# Altium schematic sheet 复旦微NB无磁水表.SchDoc
size A3; PageSetup: Record=PageOptions|CenterHorizontal=True|CenterVertical=True|PrintScale=0.90|XCorrection=1.00|YCorrection=1.00|PrintKind=0|BorderSize=5000000|LeftOffset=0|BottomOffset=0|Orientation=2|PaperLength=1000|PaperWidth=1000|Scale=100|PaperSource=7|PrintQuality=-3|MediaType=1|DitherType=10|PrintScaleMode=0|PaperKind=A3|PaperIndex=8
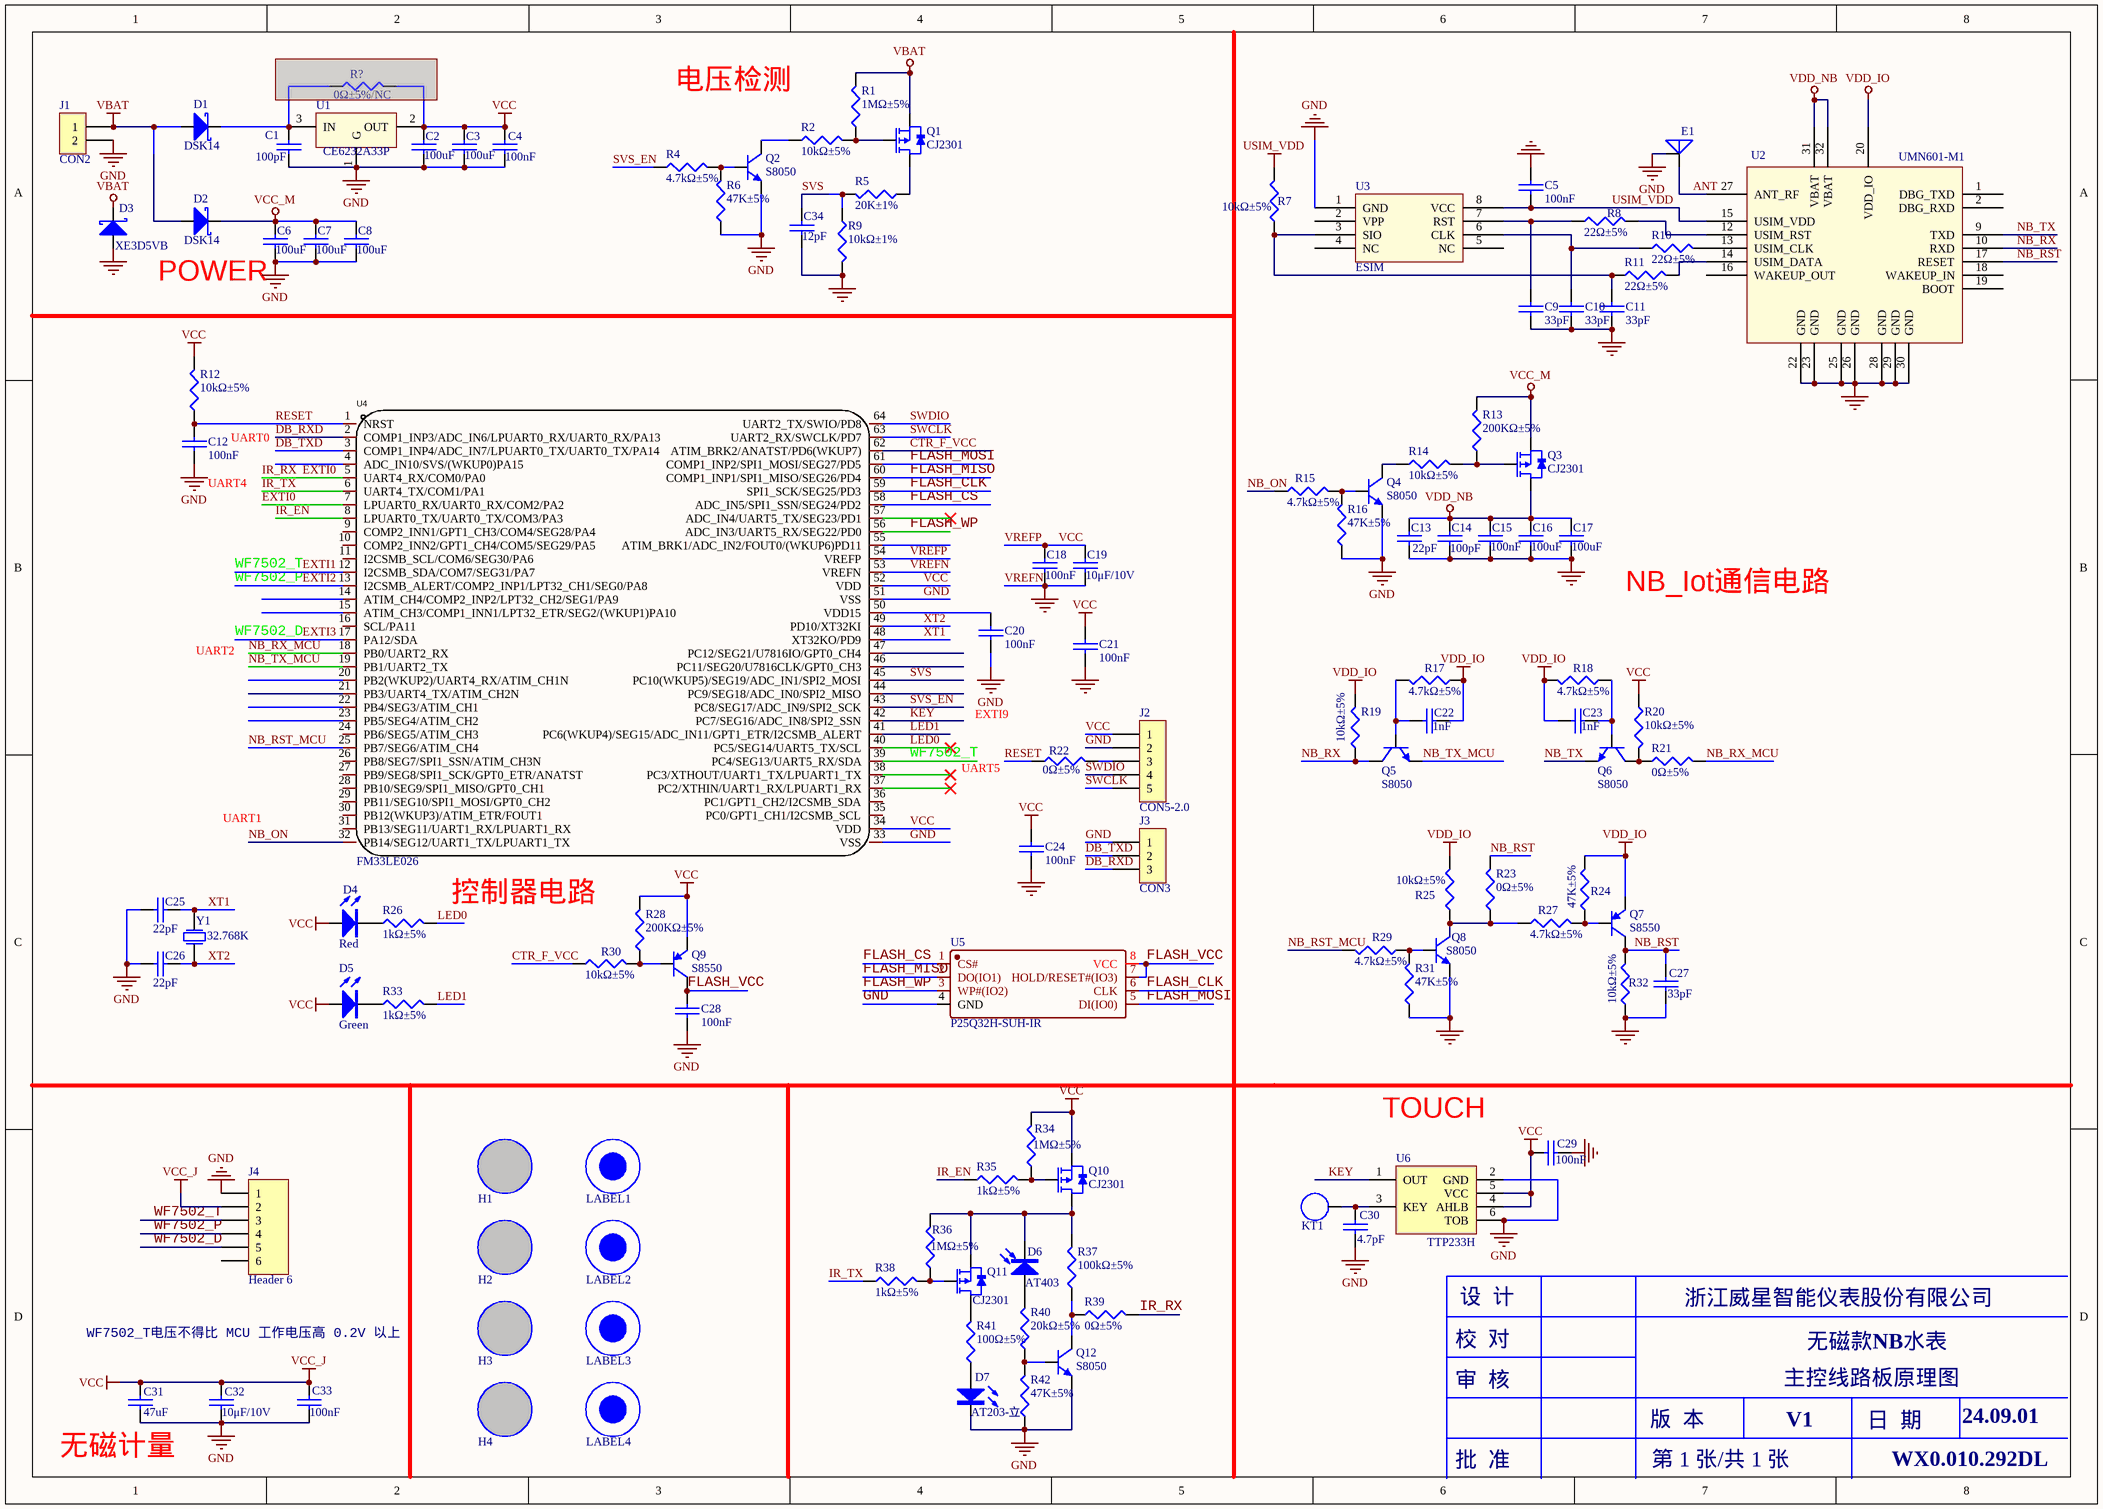
[diagram p0: 复旦微NB无磁水表.SchDoc]

## Parts
C1  100pF  [C0603]
C2  100uF  [C1206]
C3  100uF  [C1206]
C4  100nF  [C0603]
C5  100nF  [C0603]
C6  100uF  [C1206]
C7  100uF  [C1206]
C8  100uF  [C1206]
C9  33pF  [C0603]
C10  33pF  [C0603]
C11  33pF  [C0603]
C12  100nF  [C0603]
C13  22pF  [C0603]
C14  100pF  [C0603]
C15  100nF  [C0603]
C16  100uF  [C1206]
C17  100uF  [C1206]
C18  100nF  [C0603]
C19  10μF/10V  [C0603]
C20  100nF  [C0603]
C21  100nF  [C0603]
C22  1nF  [C0603]
C23  1nF  [C0603]
C24  100nF  [C0603]
C25  22pF  [C0603]
C26  22pF  [C0603]
C27  33pF  [C0603]
C28  100nF  [C0603]
C29  100nF  [C0603]
C30  4.7pF  [C0603]
C31  47uF  [C1210]
C32  10μF/10V  [C0603]
C33  100nF  [C0603]
C34  12pF  [C0603]
D1  DSK14  [SOD-123]
D2  DSK14  [SOD-123]
D3  XE3D5VB  [SOD-323_L1.8-W1.3-LS2.5-RD]
D4  Red  [LED-0603]
D5  Green  [LED-0603]
D6  AT403  [LED-3]
D7  AT203-立  [LED-3]
E1  ANTENNA_3  [ANT-3]  (value not drawn)
H1  (no value)  [HOLE-2.5]  (no BOM)
H2  (no value)  [HOLE-2.5]  (no BOM)
H3  (no value)  [HOLE-2.5]  (no BOM)
H4  (no value)  [HOLE-2.5]  (no BOM)
J1  CON2  [SIP-2]  (no BOM)
J2  CON5-2.0  [J_DIP_2.0_1*05_H]  (no BOM)
J3  CON3  [SIP-3]  (no BOM)
J4  Header 6  [PH1.27-2*3]
KT1  Touch  [TOUCH-1]  (value not drawn)
LABEL1  (no value)  [MARK]  (no BOM)
LABEL2  (no value)  [MARK]  (no BOM)
LABEL3  (no value)  [MARK]  (no BOM)
LABEL4  (no value)  [MARK]  (no BOM)
Q1  CJ2301  [SOT-23]
Q2  S8050  [SOT-23]
Q3  CJ2301  [SOT-23]
Q4  S8050  [SOT-23]
Q5  S8050  [SOT-23]
Q6  S8050  [SOT-23]
Q7  S8550  [SOT-23]
Q8  S8050  [SOT-23]
Q9  S8550  [SOT-23]
Q10  CJ2301  [SOT-23]
Q11  CJ2301  [SOT-23]
Q12  S8050  [SOT-23]
R1  1MΩ±5%  [R0603]
R2  10kΩ±5%  [R0603]
R4  4.7kΩ±5%  [R0603]
R5  20K±1%  [R0603]
R6  47K±5%  [R0603]
R7  10kΩ±5%  [R0603]
R8  22Ω±5%  [R0603]
R9  10kΩ±1%  [R0603]
R10  22Ω±5%  [R0603]
R11  22Ω±5%  [R0603]
R12  10kΩ±5%  [R0603]
R13  200KΩ±5%  [R0603]
R14  10kΩ±5%  [R0603]
R15  4.7kΩ±5%  [R0603]
R16  47K±5%  [R0603]
R17  4.7kΩ±5%  [R0603]
R18  4.7kΩ±5%  [R0603]
R19  10kΩ±5%  [R0603]
R20  10kΩ±5%  [R0603]
R21  0Ω±5%  [R0603]
R22  0Ω±5%  [R0603]
R23  0Ω±5%  [R0603]
R24  47K±5%  [R0603]
R25  10kΩ±5%  [R0603]
R26  1kΩ±5%  [R0603]
R27  4.7kΩ±5%  [R0603]
R28  200KΩ±5%  [R0603]
R29  4.7kΩ±5%  [R0603]
R30  10kΩ±5%  [R0603]
R31  47K±5%  [R0603]
R32  10kΩ±5%  [R0603]
R33  1kΩ±5%  [R0603]
R34  1MΩ±5%  [R0603]
R35  1kΩ±5%  [R0603]
R36  1MΩ±5%  [R0603]
R37  100kΩ±5%  [R0603]
R38  1kΩ±5%  [R0603]
R39  0Ω±5%  [R0603]
R40  20kΩ±5%  [R0603]
R41  100Ω±5%  [R0603]
R42  47K±5%  [R0603]
R?  0Ω±5%/NC  [R0603]  (masked out: inside a compile mask, not in the netlist)
U1  CE6232A33P  [SOT89]
U2  UMN601-M1  [MB26-Y0B]
U3  ESIM  [MFF2]
U4  FM33LE026  [LQFP-64_L10.0-W10.0-P0.50-LS12.0-BL]
U5  P25Q32H-SUH-IR  [SOIC-8]
U6  TTP233H  [SOT-23-6]
Y1  32.768K  [Y3215]

## Nets
GND: C1.1 C2.1 C3.1 C4.1 C5.1 C6.1 C7.1 C8.1 C9.1 C10.1 C11.2 C12.1 C13.1 C14.1 C15.1 C16.1 C17.1 C18.1 C19.1 C20.1 C21.1 C24.1 C25.1 C26.1 C27.1 C28.1 C29.2 C30.1 C31.1 C32.1 C33.1 C34.1 D3.1(A) D7.2(K) E1.2 J1.2 J2.2 J3.1 J4.1 Q2.2(E) Q4.2(E) Q8.2(E) Q12.2(E) R6.1 R9.2 R16.1 R31.1 R32.1 R42.1 U1.1(G) U2.22(GND) U2.23(GND) U2.25(GND) U2.26(GND) U2.28(GND) U2.29(GND) U2.30(GND) U3.1(GND) U4.33(VSS) U4.51(VSS) U4.53(VREFN) U5.4(GND) U6.2(GND) U6.6(TOB)  [also labelled VREFN]
USIM_VDD: C5.2 R7.2 U2.15(USIM_VDD) U3.8(VCC)
VBAT: D1.1(A) D2.1(A) D3.2(K) J1.1 Q1.2(S) R1.2
VCC: C2.2 C3.2 C4.2 C18.2 C19.2 C21.2 C24.2 C29.1 C31.2 C32.2 C33.2 D4.1(A) D5.1(A) J2.1 J4.2 Q9.2(E) Q10.2(S) R12.2 R20.1 R28.2 R34.2 U1.2(OUT) U4.34(VDD) U4.52(VDD) U4.54(VREFP) U6.4(AHLB) U6.5(VCC)  [also labelled VCC_J, VREFP]
VCC_M: C6.2 C7.2 C8.2 D2.2(K) Q3.2(S) R13.2
VDD_IO: C22.2 C23.1 Q7.2(E) R17.1 R18.2 R19.2 R24.2 R25.2 U2.20(VDD_IO)
VDD_NB: C13.2 C14.2 C15.2 C16.2 C17.2 Q3.3(D) U2.31(VBAT) U2.32(VBAT)
ANT: E1.1(A) U2.27(ANT_RF)
CTR_F_VCC: R30.1 U4.62(ATIM_BRK2/ANATST/PD6(WKUP7))
DB_RXD: J3.3 U4.2(COMP1_INP3/ADC_IN6/LPUART0_RX/UART0_RX/PA13)
DB_TXD: J3.2 U4.3(COMP1_INP4/ADC_IN7/LPUART0_TX/UART0_TX/PA14)
EXTI0: R39.2 U4.5(UART4_RX/COM0/PA0) U4.7(LPUART0_RX/UART0_RX/COM2/PA2)  [also labelled IR_RX]
EXTI1: J4.3 U4.12(I2CSMB_SDA/COM7/SEG31/PA7) U4.39(PC4/SEG13/UART5_RX/SDA)  [also labelled WF7502_T]
EXTI2: J4.4 U4.13(I2CSMB_ALERT/COMP2_INP1/LPT32_CH1/SEG0/PA8)  [also labelled WF7502_P]
EXTI3: J4.5 U4.17(PA12/SDA)  [also labelled WF7502_D]
FLASH_CLK: U4.59(SPI1_SCK/SEG25/PD3) U5.6(CLK)
FLASH_CS: U4.58(ADC_IN5/SPI1_SSN/SEG24/PD2) U5.1(CS#)
FLASH_MISO: U4.60(COMP1_INP1/SPI1_MISO/SEG26/PD4) U5.2(DO(IO1))
FLASH_MOSI: U4.61(COMP1_INP2/SPI1_MOSI/SEG27/PD5) U5.5(DI(IO0))
FLASH_VCC: C28.2 Q9.3(C) U5.7(HOLD/RESET#(IO3)) U5.8(VCC)
FLASH_WP: U4.56(ADC_IN3/UART5_RX/SEG22/PD0) U5.3(WP#(IO2))
IR_EN: R35.1 U4.8(LPUART0_TX/UART0_TX/COM3/PA3)
IR_TX: R38.1 U4.6(UART4_TX/COM1/PA1)
KEY: U4.42(PC7/SEG16/ADC_IN8/SPI2_SSN) U6.1(OUT)
LED0: R26.2 U4.40(PC5/SEG14/UART5_TX/SCL)
LED1: R33.2 U4.41(PC6(WKUP4)/SEG15/ADC_IN11/GPT1_ETR/I2CSMB_ALERT)
NB_ON: R15.1 U4.32(PB14/SEG12/UART1_TX/LPUART1_TX)
NB_RST: C27.2 Q7.3(C) R23.2 R32.2 U2.17(RESET)
NB_RST_MCU: R29.2 U4.25(PB7/SEG6/ATIM_CH4)
NB_RX: Q5.3(C) R19.1 U2.10(RXD)
NB_RX_MCU: R21.2 U4.18(PB0/UART2_RX)
NB_TX: Q6.2(E) U2.9(TXD)
NB_TX_MCU: Q5.2(E) U4.19(PB1/UART2_TX)
RESET: C12.2 R12.1 R22.1 U4.1(NRST)
SVS: C34.2 R5.2 R9.1 U4.45(PC10(WKUP5)/SEG19/ADC_IN1/SPI2_MOSI)
SVS_EN: R4.1 U4.43(PC8/SEG17/ADC_IN9/SPI2_SCK)
SWCLK: J2.5 U4.63(UART2_RX/SWCLK/PD7)
SWDIO: J2.4 U4.64(UART2_TX/SWIO/PD8)
XT1: C25.2 U4.48(XT32KO/PD9) Y1.2(P2)
XT2: C26.2 U4.49(PD10/XT32KI) Y1.1(P1)
NetC1_2: C1.2 D1.2(K) U1.3(IN)
NetC9_2: C9.2 R8.1 U3.7(RST)
NetC10_2: C10.2 R10.1 U3.6(CLK)
NetC11_1: C11.1 R7.1 R11.1 U3.3(SIO)
NetC20_2: C20.2 U4.50(VDD15)
NetC22_1: C22.1 Q5.1(B) R17.2
NetC23_2: C23.2 Q6.1(B) R18.1
NetC30_2: C30.2 KT1.1 U6.3(KEY)
NetD4_2: D4.2(K) R26.1
NetD5_2: D5.2(K) R33.1
NetD6_1: D6.1(A) R40.2
NetD6_2: D6.2(K) Q10.3(D) Q11.2(S) R36.2 R37.2
NetD7_1: D7.1(A) R41.1
NetJ2_3: J2.3 R22.2
NetQ1_1: Q1.1(G) R1.1 R2.2
NetQ1_3: Q1.3(D) R5.1
NetQ2_1: Q2.1(B) R4.2 R6.2
NetQ2_3: Q2.3(C) R2.1
NetQ3_1: Q3.1(G) R13.1 R14.2
NetQ4_1: Q4.1(B) R15.2 R16.2
NetQ4_3: Q4.3(C) R14.1
NetQ6_3: Q6.3(C) R20.2 R21.1
NetQ7_1: Q7.1(B) R24.1 R27.2
NetQ8_1: Q8.1(B) R29.1 R31.2
NetQ8_3: Q8.3(C) R23.1 R25.1 R27.1
NetQ9_1: Q9.1(B) R28.1 R30.2
NetQ10_1: Q10.1(G) R34.1 R35.2
NetQ11_1: Q11.1(G) R36.1 R38.2
NetQ11_3: Q11.3(D) R41.2
NetQ12_1: Q12.1(B) R40.1 R42.2
NetQ12_3: Q12.3(C) R37.1 R39.1
NetR8_2: R8.2 U2.12(USIM_RST)
NetR10_2: R10.2 U2.13(USIM_CLK)
NetR11_2: R11.2 U2.14(USIM_DATA)

Not connected (* = marked no-connect by the designer): J4 6; U2 1(DBG_TXD) 2(DBG_RXD) 16(WAKEUP_OUT) 18(WAKEUP_IN) 19(BOOT); U3 2(VPP) 4(NC) 5(NC); U4 4(ADC_IN10/SVS/(WKUP0)PA15) 9(COMP2_INN1/GPT1_CH3/COM4/SEG28/PA4) 10(COMP2_INN2/GPT1_CH4/COM5/SEG29/PA5) 11(I2CSMB_SCL/COM6/SEG30/PA6) 14(ATIM_CH4/COMP2_INP2/LPT32_CH2/SEG1/PA9) 15(ATIM_CH3/COMP1_INN1/LPT32_ETR/SEG2/(WKUP1)PA10) 16(SCL/PA11) 20(PB2(WKUP2)/UART4_RX/ATIM_CH1N) 21(PB3/UART4_TX/ATIM_CH2N) 22(PB4/SEG3/ATIM_CH1) 23(PB5/SEG4/ATIM_CH2) 24(PB6/SEG5/ATIM_CH3) 26(PB8/SEG7/SPI1_SSN/ATIM_CH3N) 27(PB9/SEG8/SPI1_SCK/GPT0_ETR/ANATST) 28(PB10/SEG9/SPI1_MISO/GPT0_CH1) 29(PB11/SEG10/SPI1_MOSI/GPT0_CH2) 30(PB12(WKUP3)/ATIM_ETR/FOUT1) 31(PB13/SEG11/UART1_RX/LPUART1_RX) 35(PC0/GPT1_CH1/I2CSMB_SCL) 36(PC1/GPT1_CH2/I2CSMB_SDA) 37(PC2/XTHIN/UART1_RX/LPUART1_RX)* 38(PC3/XTHOUT/UART1_TX/LPUART1_TX)* 44(PC9/SEG18/ADC_IN0/SPI2_MISO) 46(PC11/SEG20/U7816CLK/GPT0_CH3) 47(PC12/SEG21/U7816IO/GPT0_CH4) 55(ATIM_BRK1/ADC_IN2/FOUT0/(WKUP6)PD11) 57(ADC_IN4/UART5_TX/SEG23/PD1)*

## Notes on the sheet
- 电压检测
- POWER
- UART0
- (near C12) UART4
- UART2
- NB_Iot通信电路
- EXTI9
- UART5
- UART1
- 控制器电路
- TOUCH
- 设  计
- 浙江威星智能仪表股份有限公司
- WF7502_T电压不得比 MCU 工作电压高 0.2V 以上
- 审  核
- 校  对
- 主控线路板原理图
- 无磁款NB水表
- (near C31) 无磁计量
- 版  本
- V1
- 日  期
- 24.09.01
- 批  准
- 第 1 张/共 1 张
- WX0.010.292DL

## Library data of the parts
C1 C14 = 9: 贴片电容,100pF±10%/50V,NP0,国巨; Part Number: 101020103-0010; Manufacturer P/N: CC0603JRNPO9BN101; ID: 9; Part Name: 贴片电容; Manufacturer: 国巨
C2 C3 C6-C8 C16 C17 = 16: 贴片电容,100uF±20%/6.3V,X5R,村田; Part Number: 101020101-0020; Manufacturer P/N: GRM31CR60J107ME39L; ID: 16; Part Name: 贴片电容; Manufacturer: 村田
C4 C5 C12 C15 C18 C20 C21 C24 C28 C29 C33 = 1: 贴片电容,100nF±10%/50V,X7R,国巨; Part Number: 101020103-0021; Manufacturer P/N: CC0603KRX7R9BB104; ID: 1; Part Name: 贴片电容; Manufacturer: 国巨
C9-C11 C27 = 4: 贴片电容,33pF±10%/50V,NP0,国巨; Part Number: 101020103-0027; Manufacturer P/N: CC0603KRNPO9BN33; ID: 4; Part Name: 贴片电容; Manufacturer: 国巨
C13 C25 C26 = 3: 贴片电容,22pF±5%/50V,NP0,国巨; Part Number: 101020103-0009; Manufacturer P/N: CC0603JRNPO9BN22; ID: 3; Part Name: 贴片电容; Manufacturer: 国巨
C19 C32 = 8: 贴片电容,10μF±10%/10V,X7R,村田; Part Number: 101020103-0026; Manufacturer P/N: GRM188R61A106KE47D; ID: 8; Part Name: 贴片电容; Manufacturer: 村田
C22 C23 = 6: 贴片电容,1nF±10%/50V,X7R,国巨; Part Number: 101020103-0022; Manufacturer P/N: CC0603KRX7R9BB102; ID: 6; Part Name: 贴片电容; Manufacturer: 国巨
C30 = 18: 贴片电容,4.7pF±0.25pF/50V,NPO,国巨; Part Number: 101020103-0040; Manufacturer P/N: CC0603CRNP09BN4R7; ID: 18; Part Name: 贴片电容; Manufacturer: 国巨
C31 = 11: 贴片电容,47uF±10%/16V,NP0,村田; Part Number: 101020105-0003; Manufacturer P/N: GRM32ER61C476KE15L; ID: 11; Part Name: 贴片电容; Manufacturer: 村田
C34 = 15: 贴片电容,12pF±5%/50V,NPO,国巨; Part Number: 101020103-0005; Manufacturer P/N: CC0603JRNPO9BN12; ID: 15; Part Name: 贴片电容; Manufacturer: 国巨
D1 D2 = 8: DSK14,SOD-123FL,1 A,40 V,28 V,台湾强茂集团苏州群鑫电子,DSK14; Part Number: 101040101-0043; Part Name: 贴片二极管; ID: 8; Manufacturer: 台湾强茂集团苏州群鑫电子
D3 = 12: 具有3.5pF低结电容，适用于IO线、电源线、高速信号的ESD二极管阵列,SOD-323,5 V,5 V,350 W,5 A,1 uA,矽航,XE3D5VB; Part Number: 101040104-0010; Part Name: ESD管; ID: 12; Manufacturer: 矽航
D4 = 3: 发光二极管,红色,0603,光宝; Part Number: 101040102-0006; ID: 3; Part Name: 发光二极管; Manufacturer: 光宝
D5 = 5: 发光二极管,绿色,亿光，19-217/GHC-YR1S2/3T; Part Number: 101040102-0018; Part Name: 贴片发光二极管; Manufacturer: 亿光; ID: 5; Manufacturer P/N: 19-217/GHC-YR1S2/3T
D6 = 6: 红外接收头，插件，红光，AT403_PD_01; Part Number: 101040102-0011; Part Name: 红外接收管; Manufacturer: 品观; ID: 6; SMD/DIP: DIP
D7 = 5: 红外发射头，插件，红光，AT203; Part Number: 101040102-0010; Part Name: 红外发射管; Manufacturer: 品观; ID: 5
E1 = 28: 外置天线焊盘（固定孔）; Part Name: 虚拟器件; ID: 28; Part Number: *
H1-H4 = 22: 定位孔,孔径2.5mm,非金属化,无电气连接; Part Name: 虚拟器件; ID: 22; Part Number: *
J1 = 1: 焊接插座,间距2.54mm; ID: 1; Part Number: *; Part Name: 焊接插座
J2 = 15: 焊接插座,间距2.0mm; Part Name: 焊接插件; ID: 15
J3 = 2: 焊接插座,间距2.54mm; ID: 2; Part Number: *; Part Name: 焊接插座
J4 = Header 6: Header, 6-Pin; LatestRevisionDate: 17-Jul-2002; LatestRevisionNote: Re-released for DXP Platform.; Publisher: 1110705-0004
KT1 = 2: 按键,6mm弹簧按键,按键直径10mm; Part Number: 1011001-0060; ID: 2; Part Name: 按键
LABEL1-LABEL4 = 1: 标准Mark点,直径1mm,阻焊开窗3mm; Part Name: 虚拟器件; ID: 1; Part Number: *
Q1 Q3 Q10 Q11 = 2: 贴片MOS管,PMOS,CJ2301,江苏长电; Part Number: 101040201-0019; ID: 2; Part Name: 贴片MOS管; Manufacturer: 江苏长电
Q2 Q4-Q6 Q8 Q12 = 1: 贴片三极管,NPN,S8050(L),江苏长电; Part Number: 101040201-0003; ID: 1; Part Name: 贴片三极管; Manufacturer: 江苏长电
Q7 Q9 = 2: 贴片三极管,PNP,S8550(L),江苏长电; Part Number: 101040201-0004; ID: 2; Part Name: 贴片三极管; Manufacturer: 江苏长电
R1 R34 R36 = 4: 贴片电阻,1MΩ±5%,1/10W,100ppm/℃,国巨; Part Number: 101010103-0002; Manufacturer P/N: RC0603JR-071ML; ID: 4; Part Name: 贴片电阻; Manufacturer: 国巨
R2 R7 R12 R14 R19 R20 R25 R30 R32 = 2: 贴片电阻,10kΩ±5%,1/10W,100ppm/℃,国巨; Part Number: 101010103-0003; Manufacturer P/N: RC0603JR-0710KL; ID: 2; Part Name: 贴片电阻; Manufacturer: 国巨
R4 R15 R17 R18 R27 R29 = 12: 贴片电阻,4.7kΩ±5%,1/10W,100ppm/℃,国巨; Part Number: 101010103-0042; Manufacturer P/N: RC0603JR-074K7L; ID: 12; Part Name: 贴片电阻; Manufacturer: 国巨
R5 = 23: 贴片电阻，20K,±1%,1/10W,0603,国巨,RC0603FR-0720KL; Part Number: 101010103-0048; Part Name: 贴片电阻; ID: 23; Manufacturer: 国巨; Manufacturer P/N: RC0603FR-0720KL
R6 R16 R24 R31 R42 = 22: 贴片电阻，47K,±5%,1/10W,0603,国巨,RC0603JR-0747KL; Part Number: 101010103-0012; Part Name: 贴片电阻; ID: 22; Manufacturer: 国巨; Manufacturer P/N: RC0603JR-0747KL
R8 R10 R11 = 14: 贴片电阻,22Ω±5%,1/10W,100ppm/℃,国巨; Part Number: 101010103-0009; Manufacturer P/N: RC0603JR-0722RL; ID: 14; Part Name: 贴片电阻; Manufacturer: 国巨
R9 = 6: 贴片电阻,10kΩ±1%,1/10W,100ppm/℃,国巨; Part Number: 101010103-0052; Manufacturer P/N: RC0603FR-0710KL; ID: 6; Part Name: 贴片电阻; Manufacturer: 国巨
R13 R28 = 16: 贴片电阻,200kΩ±5%,200mW,100ppm/℃,国巨; Part Number: 101010103-0034; Manufacturer P/N: RC0603JR-07200KL; ID: 16; Part Name: 贴片电阻; Manufacturer: 国巨
R21-R23 R39 R? = 15: 贴片电阻,0Ω±5%,1/10W,100ppm/℃,国巨; Part Number: 101010103-0001; Manufacturer P/N: RC0603JR-070RL; ID: 15; Part Name: 贴片电阻; Manufacturer: 国巨
R26 R33 R35 R38 = 1: 贴片电阻,1kΩ±5%,1/10W,100ppm/℃,国巨; Part Number: 101010103-0008; Manufacturer P/N: RC0603JR-071KL; ID: 1; Part Name: 贴片电阻; Manufacturer: 国巨
R37 = 3: 贴片电阻,100kΩ±5%,1/10W,100ppm/℃,国巨; Part Number: 101010103-0005; Manufacturer P/N: RC0603JR-07100KL; ID: 3; Part Name: 贴片电阻; Manufacturer: 国巨
R40 = 7: 贴片电阻,20kΩ±5%,1/10W,100ppm/℃,国巨; Part Number: 101010103-0004; Manufacturer P/N: RC0603FR-0720KL; ID: 7; Part Name: 贴片电阻; Manufacturer: 国巨
R41 = 5: 贴片电阻,100Ω±5%,1/10W,100ppm/℃,国巨; Part Number: 101010103-0022; Manufacturer P/N: RC0603JR-07100RL; ID: 5; Part Name: 贴片电阻; Manufacturer: 国巨
U1 = 6: 集成电路，CE6232A33P,SOT89; Part Name: 集成电路; Part Number: 1010503-0029; ID: 6; Manufacturer: CE6232A33P; Manufacturer P/N: CE6232A33P
U2 = 13: 集成电路,UMN601-M1,九联; Part Number: 1011402-0246; Manufacturer: 九联科技; ID: 13; Part Name: 集成电路
U3 = 2: 集成电路,ESIM,杭州电信; Part Number: 101050101-0120; Manufacturer: 电信; ID: 2; Part Name: 集成电路
U4 = 10: 单片机,FM33LE026,复旦微; Part Name: 集成电路; Part Number: 101050101-0352; Symbol: FM33LC026N; Add into BOM: yes; CPU Core: CM0; Program Storage Size: 128KB; RAM Size: 24KB; GPIO Ports Number: 54; Operating Voltage Range: 1.8V~5.5V; CPU Maximum Speed: 64MHz; Program Memory Type: FLASH; ADC (Bit): 12bit; 16Bit Timer: 3; 32Bit Timer: 2; UART/USART: 6; I2C: 1; Internal Comparator: ��; Peripheral/Function: Ƭ���¶ȴ����������Ź����͵�ѹ��⣻Ӳ�������㷨���棻PWM��CCP����/�Ƚϣ�LCD/LED���������������������RTCʵʱʱ��; ID: 10; Device: FM33LC026N; Supplier: LCSC; Supplier Part: C648829; Manufacturer: 复旦微; Manufacturer Part: FM33LC026N; JLCPCB Part Class: Extended Part; LCSC Part Name: LC0ϵ�е͹���; Supplier Footprint: LQFP-64(10x10); Datasheet: https://atta.szlcsc.com/upload/public/pdf/source/20200616/C648829_514A77D3BF4E1F83D99F50A2DA443E89.pdf; Convert to PCB: yes; Operating Temperature Range: -40��~+85��; DAC (Bit): -; PWM (Bit): -; SPI: 2; Universal Serial Bus: -; communication protocol: -; Watchdog: ��; Real-Time Clock: ��; Infrared Data Association: -; Low-Voltage Detect: ��; CCP Capture/Compare: ��; Secure Digital Input and Output: -; Direct Memory Access: -; Internal Oscillator: ��
U5 = 10: 集成电路，P25Q32H-SUH-IR，SOP-8,普冉半导体（上海）; Part Number: 101050101-0219; Part Name: 集成电路; ID: 10; Manufacturer: 普冉半导体（上海）
U6 = 5: 集成电路，TTP233H,TONTEK; Part Number: 101050101-0262; Part Name: 集成电路; Manufacturer P/N: TTP233H-HA6; ID: 5; Manufacturer: TONTEK
Y1 = 2: 晶振,32.768KHz,±20ppm,12.5pF,3215,EPSON; Part Number: 1010601-0009; ID: 2; Part Name: 晶振; Manufacturer: EPSON